# Altium schematic sheet TP_Integrador_Palomino_Villafane_Manuel_Blk_R00.SchDoc
size A4; SheetNumber: 1; SheetTotal: 2
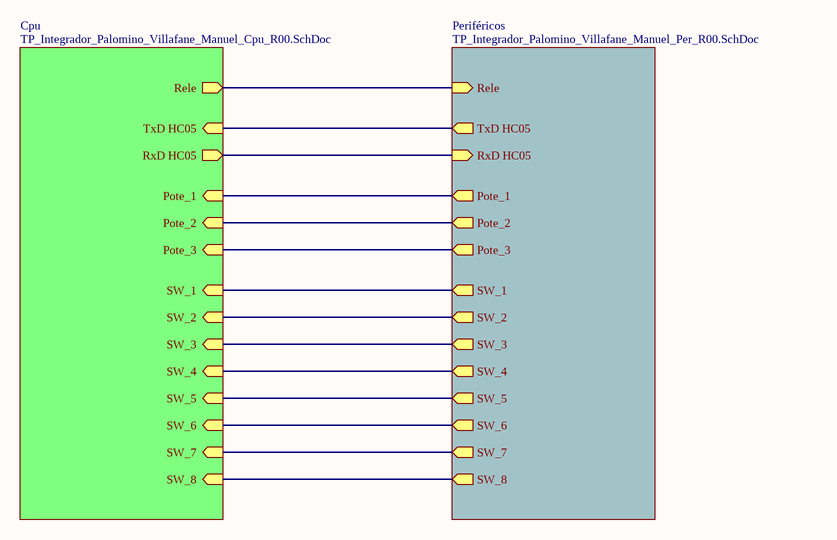
[diagram p0: TP_Integrador_Palomino_Villafane_Manuel_Blk_R00.SchDoc]

## Sub-sheets
Cpu = TP_Integrador_Palomino_Villafane_Manuel_Cpu_R00.SchDoc: RxD HC05 (out), TxD HC05 (in), Pote_1 (in), Rele (out), SW_2 (in), Pote_2 (in), Pote_3 (in), SW_3 (in), SW_4 (in), SW_5 (in), SW_6 (in), SW_7 (in), SW_8 (in), SW_1 (in)
Periféricos = TP_Integrador_Palomino_Villafane_Manuel_Per_R00.SchDoc: RxD HC05 (in), TxD HC05 (out), Rele (in), Pote_1 (out), Pote_2 (out), Pote_3 (out), SW_2 (out), SW_3 (out), SW_4 (out), SW_5 (out), SW_6 (out), SW_7 (out), SW_8 (out), SW_1 (out)

## Nets
(unnamed): sheet Cpu/RxD HC05, sheet Periféricos/RxD HC05
(unnamed): sheet Cpu/TxD HC05, sheet Periféricos/TxD HC05
(unnamed): sheet Cpu/Pote_1, sheet Periféricos/Pote_1
(unnamed): sheet Cpu/Rele, sheet Periféricos/Rele
(unnamed): sheet Cpu/SW_2, sheet Periféricos/SW_2
(unnamed): sheet Cpu/Pote_2, sheet Periféricos/Pote_2
(unnamed): sheet Cpu/Pote_3, sheet Periféricos/Pote_3
(unnamed): sheet Cpu/SW_3, sheet Periféricos/SW_3
(unnamed): sheet Cpu/SW_4, sheet Periféricos/SW_4
(unnamed): sheet Cpu/SW_5, sheet Periféricos/SW_5
(unnamed): sheet Cpu/SW_6, sheet Periféricos/SW_6
(unnamed): sheet Cpu/SW_7, sheet Periféricos/SW_7
(unnamed): sheet Cpu/SW_8, sheet Periféricos/SW_8
(unnamed): sheet Cpu/SW_1, sheet Periféricos/SW_1